# EAGLE schematic UniDie (EAGLE 9.1.0)
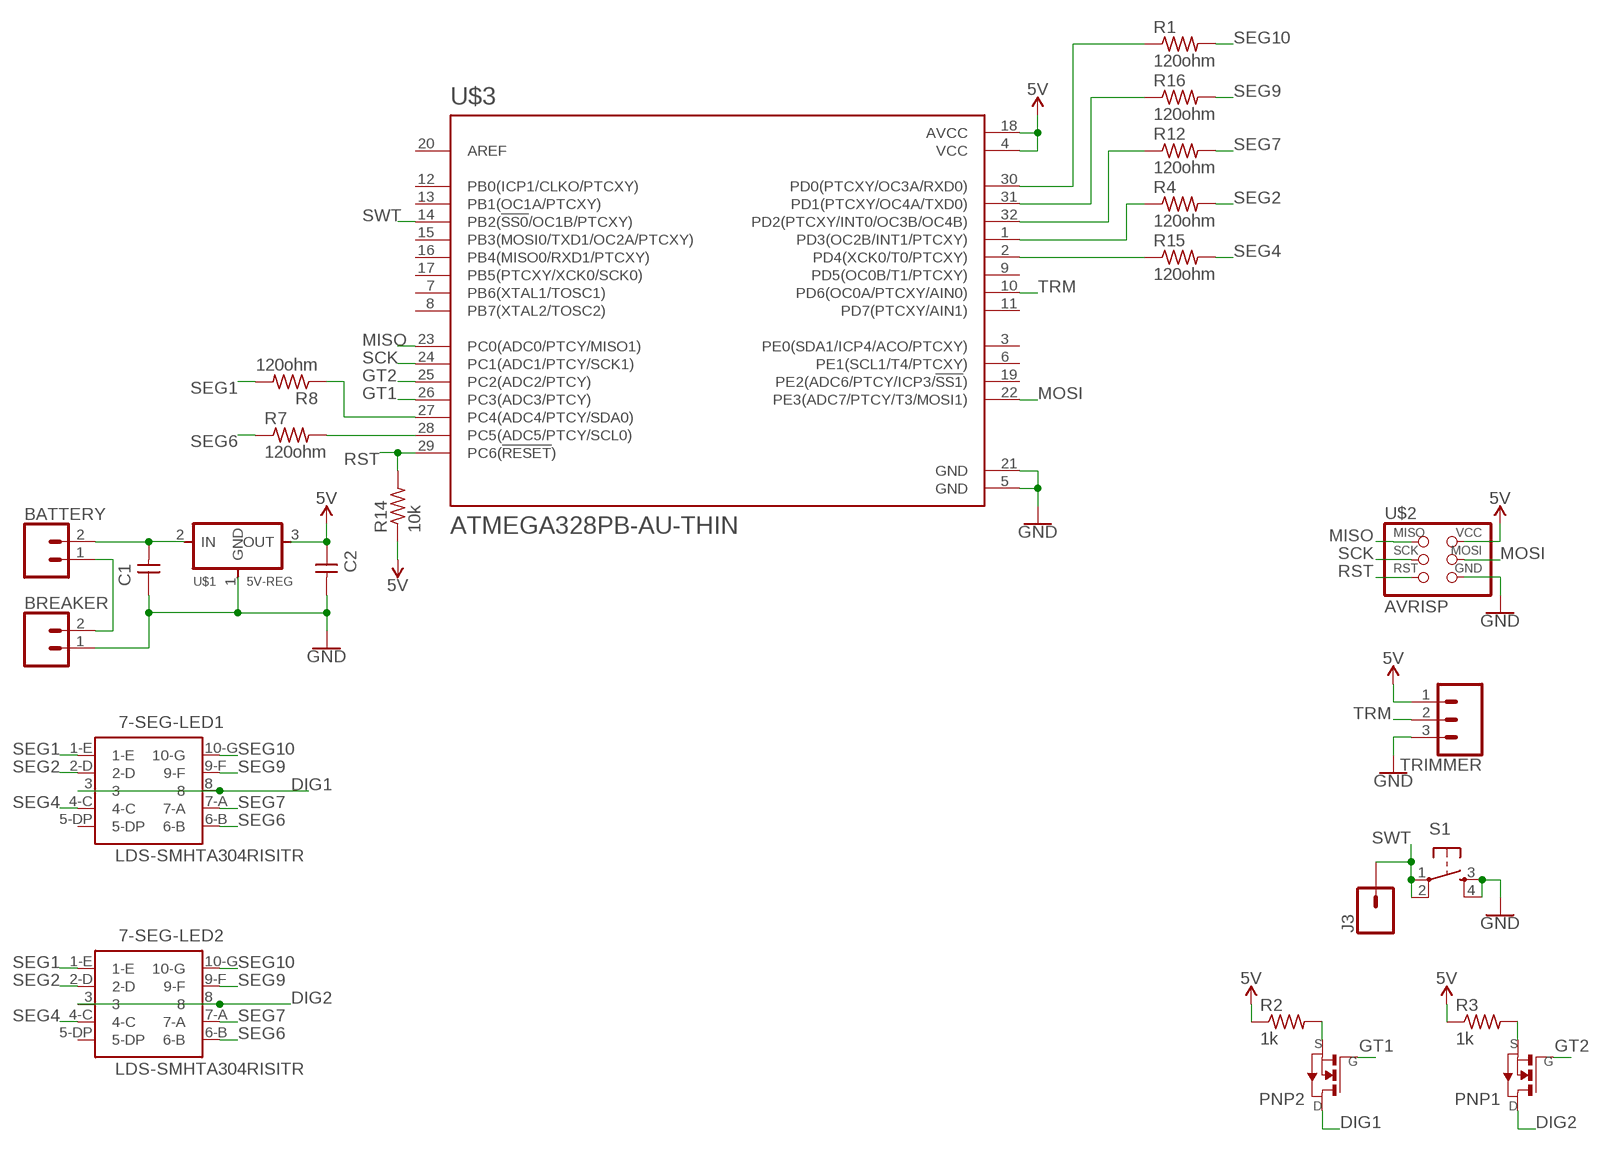
[diagram p0: schematic, sheet 1]

## Parts
7-SEG-LED1  LDS-SMHTA304RISITR  [10-SMD]
7-SEG-LED2  LDS-SMHTA304RISITR  [10-SMD]
BATTERY  CONN_021X02_NO_SILK  [1X02_NO_SILK]
BREAKER  CONN_021X02_NO_SILK  [1X02_NO_SILK]
C1  CAP-UNPOLARIZEDFAB  [C1206FAB]
C2  CAP-UNPOLARIZEDFAB  [C1206FAB]
J3  CONN_01PTH_NO_SILK_YES_STOP  [1X01_NO_SILK]
PNP1  NMOSFETSOT23  [SOT-23]
PNP2  NMOSFETSOT23  [SOT-23]
R1  120ohm  RES-US1206FAB  [R1206FAB]
R2  1k  RES-US1206FAB  [R1206FAB]
R3  1k  RES-US1206FAB  [R1206FAB]
R4  120ohm  RES-US1206FAB  [R1206FAB]
R7  120ohm  RES-US1206FAB  [R1206FAB]
R8  120ohm  RES-US1206FAB  [R1206FAB]
R12  120ohm  RES-US1206FAB  [R1206FAB]
R14  10k  RES-US1206FAB  [R1206FAB]
R15  120ohm  RES-US1206FAB  [R1206FAB]
R16  120ohm  RES-US1206FAB  [R1206FAB]
S1  6MM_SWITCH6MM_SWITCH  [6MM_SWITCH]
TRIMMER  CONN_031X03_NO_SILK  [1X03_NO_SILK]
U$1  5V-REG  [SOT-23]
U$2  AVRISP  [2X03]
U$3  ATMEGA328PB-AU-THIN  [TQFP32-08THIN]

## Nets
5V: C2.1 R2.1 R3.1 R14.1 TRIMMER.1 U$1.3(OUT) U$2.2(VCC) U$3.4(VCC) U$3.18(AVCC)
DIG1: 7-SEG-LED1.3 7-SEG-LED1.8 PNP2.1(D)
DIG2: 7-SEG-LED2.3 7-SEG-LED2.8 PNP1.1(D)
GND: BREAKER.1 C1.1 C2.2 S1.3(S) S1.4(S1) TRIMMER.3 U$1.1(GND) U$2.6(GND) U$3.5(GND) U$3.21(GND)
GT1: PNP2.3(G) U$3.26(PC3(ADC3/PTCY))
GT2: PNP1.3(G) U$3.25(PC2(ADC2/PTCY))
MISO: U$2.1(MISO) U$3.23(PC0(ADC0/PTCY/MISO1))
MOSI: U$2.4(MOSI) U$3.22(PE3(ADC7/PTCY/T3/MOSI1))
N$1: BATTERY.2 C1.2 U$1.2(IN)
N$2: PNP1.2(S) R3.2
N$3: R7.2 U$3.28(PC5(ADC5/PTCY/SCL0))
N$4: R8.1 U$3.27(PC4(ADC4/PTCY/SDA0))
N$5: BATTERY.1 BREAKER.2
N$6: R15.1 U$3.2(PD4(XCK0/T0/PTCXY))
N$7: R4.1 U$3.1(PD3(OC2B/INT1/PTCXY))
N$8: R12.1 U$3.32(PD2(PTCXY/INT0/OC3B/OC4B))
N$9: R16.1 U$3.31(PD1(PTCXY/OC4A/TXD0))
N$10: R1.1 U$3.30(PD0(PTCXY/OC3A/RXD0))
N$13: PNP2.2(S) R2.2
RST: R14.2 U$2.5(RST) U$3.29(PC6(!RESET!))
SCK: U$2.3(SCK) U$3.24(PC1(ADC1/PTCY/SCK1))
SEG1: 7-SEG-LED1.1-E 7-SEG-LED2.1-E R8.2
SEG2: 7-SEG-LED1.2-D 7-SEG-LED2.2-D R4.2
SEG4: 7-SEG-LED1.4-C 7-SEG-LED2.4-C R15.2
SEG6: 7-SEG-LED1.6-B 7-SEG-LED2.6-B R7.1
SEG7: 7-SEG-LED1.7-A 7-SEG-LED2.7-A R12.2
SEG9: 7-SEG-LED1.9-F 7-SEG-LED2.9-F R16.2
SEG10: 7-SEG-LED1.10-G 7-SEG-LED2.10-G R1.2
SWT: J3.1 S1.1(P) S1.2(P1) U$3.14(PB2(!SS0!/OC1B/PTCXY))
TRM: TRIMMER.2 U$3.10(PD6(OC0A/PTCXY/AIN0))
Unconnected: 7-SEG-LED1.5-DP 7-SEG-LED2.5-DP U$3.3(PE0(SDA1/ICP4/ACO/PTCXY)) U$3.6(PE1(SCL1/T4/PTCXY)) U$3.7(PB6(XTAL1/TOSC1)) U$3.8(PB7(XTAL2/TOSC2)) U$3.9(PD5(OC0B/T1/PTCXY)) U$3.11(PD7(PTCXY/AIN1)) U$3.12(PB0(ICP1/CLKO/PTCXY)) U$3.13(PB1(OC1A/PTCXY)) U$3.15(PB3(MOSI0/TXD1/OC2A/PTCXY)) U$3.16(PB4(MISO0/RXD1/PTCXY)) U$3.17(PB5(PTCXY/XCK0/SCK0)) U$3.19(PE2(ADC6/PTCY/ICP3/!SS1!)) U$3.20(AREF)

## Library data of the parts
7-SEG-LED1 7-SEG-LED2 = AG:LDS-SMHTA304RISITR: LDS-SMHTA304RISITR <https://www.lumex.com/spec/LDS-SMHTA304RISITR.pdf> Character LED Display Module Red 7-Segment 1 Character Common Anode 1.95V 20mA 0.394" H x 0.287" W x 0.154" D (10.00mm x 7.30mm x 3.90mm) 10-SMD No Lead Manufacturer: Lumex Opto/Components Inc. <https://www.digikey.com/en/supplier-centers/l/lumex>
BATTERY BREAKER = SparkFun-Connectors:CONN_02: Multi connection point. Often used as Generic Header-pin footprint for 0.1 inch spaced/style header connections On any of the 0.1 inch spaced packages, you can populate with these: Break Away Headers - Straight <https://www.sparkfun.com/products/116> (PRT-00116) Break Away Male Headers - Right Angle <https://www.sparkfun.com/products/553> (PRT-00553) Female Headers <https://www.sparkfun.com/products/115> (PRT-00115) Break Away Headers - Machine Pin <https://www.sparkfun.com/products/117> (PRT-00117) Break Away Female Headers - Swiss Machine Pin <https://www.sparkfun.com/products/743> (PRT-00743) For SCREWTERMINALS and SPRING TERMINALS visit here: Screw Terimnals on SparkFun.com <https://www.sparkfun.com/search/results?term=Screw+Terminals> (5mm/3.5mm/2.54mm spacing) This device is also useful as a general connection point to wire up your design to another part of your project. Our various solder wires solder well into these plated through hole pads. Hook-Up Wire - Assortment (Stranded, 22 AWG) <https://www.sparkfun.com/products/11375> (PRT-11375) Hook-Up Wire - Assortment (Solid Core, 22 AWG) <https://www.sparkfun.com/products/11367> (PRT-11367) View the entire wire category on our website here <https://www.sparkfun.com/categories/141> Special notes: Molex polarized connector foot print use with: PRT-08233 with associated crimp pins and housings. 2.54_SCREWTERM for use with PRT-10571. 3.5mm Screw Terminal footprints for PRT-08084 5mm Screw Terminal footprints for use with PRT-08432
C1 C2 = fab:CAP-UNPOLARIZED
J3 = SparkFun-Connectors:CONN_01: Single connection point. Often used as Generic Header-pin footprint for 0.1 inch spaced/style header connections On any of the 0.1 inch spaced packages, you can populate with these: Break Away Headers - Straight <https://www.sparkfun.com/products/116> (PRT-00116) Break Away Male Headers - Right Angle <https://www.sparkfun.com/products/553> (PRT-00553) Female Headers <https://www.sparkfun.com/products/115> (PRT-00115) Break Away Headers - Machine Pin <https://www.sparkfun.com/products/117> (PRT-00117) Break Away Female Headers - Swiss Machine Pin <https://www.sparkfun.com/products/743> (PRT-00743) This device is also useful as a general connection point to wire up your design to another part of your project. Our various solder wires solder well into these plated through hole pads. Hook-Up Wire - Assortment (Stranded, 22 AWG) <https://www.sparkfun.com/products/11375> (PRT-11375) Hook-Up Wire - Assortment (Solid Core, 22 AWG) <https://www.sparkfun.com/products/11367> (PRT-11367) View the entire wire category on our website here <https://www.sparkfun.com/categories/141> Special notes: SMTSO-256-ET is a "flush mount" nut for a 4-40 screw. We mostly use this on specialty testbeds; it is a nice way to connect hardware to your PCB at an adjustable hieght. Also note, the SNAP packages are for using a snappable style connector. We sell a baggie of snaps and they are also used on two LilyPad designs: Snap Assortment - 30 pack (male and female) <https://www.sparkfun.com/products/11347> (DEV-11347) LilyPad Arduino SimpleSnap <https://www.sparkfun.com/products/10941> (DEV-10941) LilyPad SimpleSnap Protoboard <https://www.sparkfun.com/products/10940> (DEV-10940)
PNP1 PNP2 = fab:NMOSFET: MOS FET
R1-R4 R7 R8 R12 R14-R16 = fab:RES-US: Resistor (US Symbol) Variants with postfix FAB are widened to allow the routing of internal traces
S1 = fab:6MM_SWITCH: OMRON SWITCH
TRIMMER = SparkFun-Connectors:CONN_03: Multi connection point. Often used as Generic Header-pin footprint for 0.1 inch spaced/style header connections On any of the 0.1 inch spaced packages, you can populate with these: Break Away Headers - Straight <https://www.sparkfun.com/products/116> (PRT-00116) Break Away Male Headers - Right Angle <https://www.sparkfun.com/products/553> (PRT-00553) Female Headers <https://www.sparkfun.com/products/115> (PRT-00115) Break Away Headers - Machine Pin <https://www.sparkfun.com/products/117> (PRT-00117) Break Away Female Headers - Swiss Machine Pin <https://www.sparkfun.com/products/743> (PRT-00743) Stackable Header - 3 Pin (Female, 0.1") <https://www.sparkfun.com/products/13875> (PRT-13875) For SCREWTERMINALS and SPRING TERMINALS visit here: Screw Terimnals on SparkFun.com <https://www.sparkfun.com/search/results?term=Screw+Terminals> (5mm/3.5mm/2.54mm spacing) This device is also useful as a general connection point to wire up your design to another part of your project. Our various solder wires solder well into these plated through hole pads. Hook-Up Wire - Assortment (Stranded, 22 AWG) <https://www.sparkfun.com/products/11375> (PRT-11375) Hook-Up Wire - Assortment (Solid Core, 22 AWG) <https://www.sparkfun.com/products/11367> (PRT-11367) View the entire wire category on our website here <https://www.sparkfun.com/categories/141> Special notes: Molex polarized connector foot print use with SKU : PRT-08232 with associated crimp pins and housings.
U$1 = AG:5V-REG: The usual sot-23 5v voltage regulator, but with thinner pads to allow 1/64" routing beneath it.
U$2 = fab:AVRISP
U$3 = AG:ATMEGA328PB-AU-THIN: ATmega328PB version with 2 GNDs and thin traces (so to mill it with 1/64th inch drill bit)